# EAGLE design Clock2 (EAGLE 6.5.0)
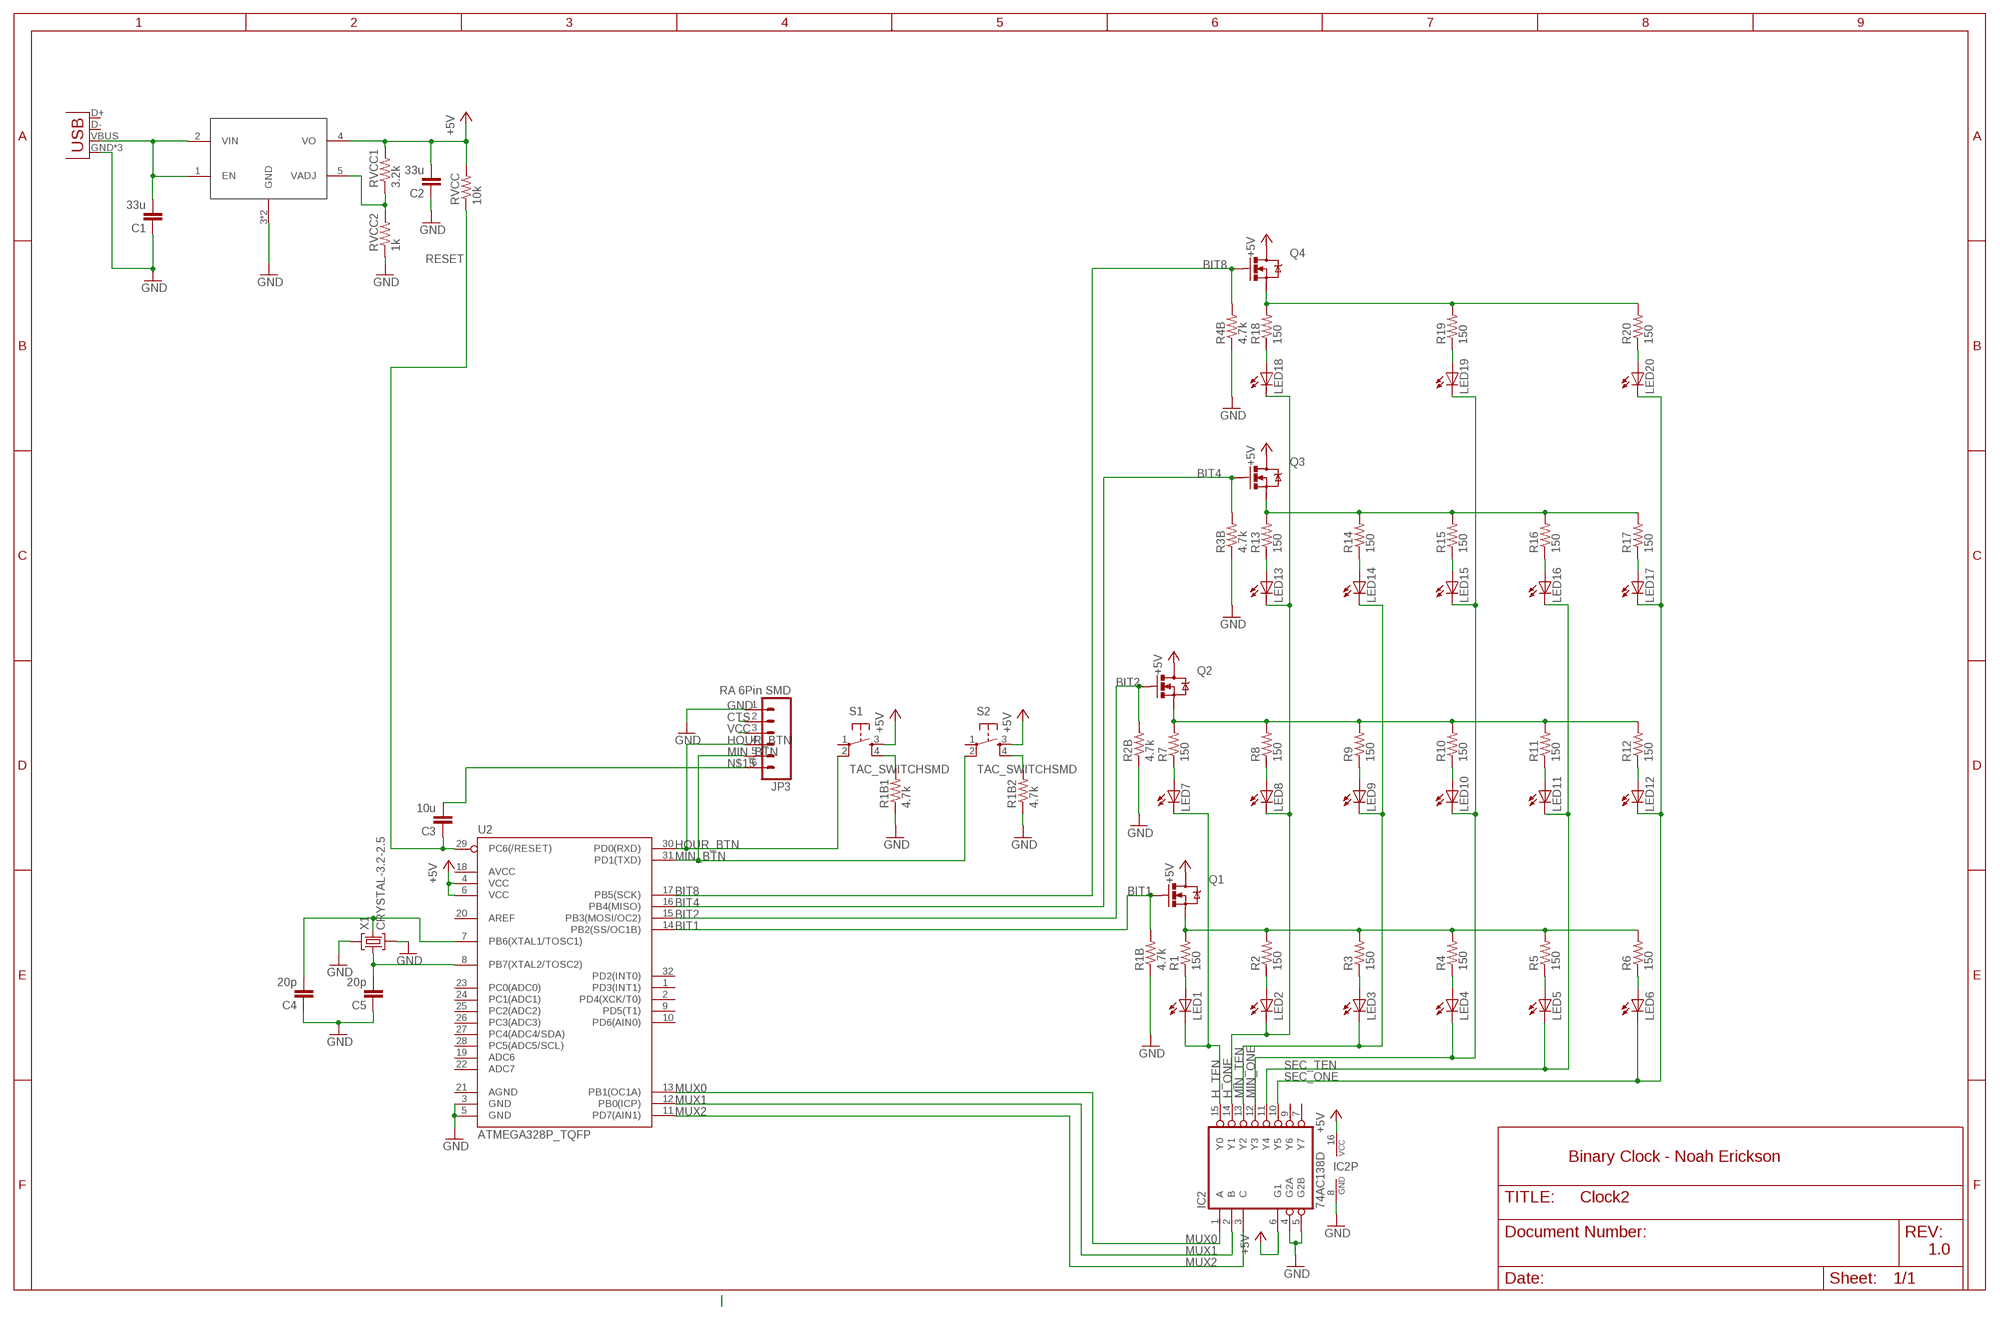
[diagram p0: schematic, sheet 1]

## Parts
C1  33u  C-EUC1206  [C1206]
C2  33u  C-EUC1206  [C1206]
C3  10u  C-EUC1206  [C1206]
C4  20p  C-EUC1206  [C1206]
C5  20p  C-EUC1206  [C1206]
IC2  74AC138D  [SO16]
JP1  USB-MICROB  [USB-MICROB]
JP3  RA 6Pin SMD  M06SMD  [1X06-SMD]
LED1  LEDSML1206  [SML1206]
LED2  LEDSML1206  [SML1206]
LED3  LEDSML1206  [SML1206]
LED4  LEDSML1206  [SML1206]
LED5  LEDSML1206  [SML1206]
LED6  LEDSML1206  [SML1206]
LED7  LEDSML1206  [SML1206]
LED8  LEDSML1206  [SML1206]
LED9  LEDSML1206  [SML1206]
LED10  LEDSML1206  [SML1206]
LED11  LEDSML1206  [SML1206]
LED12  LEDSML1206  [SML1206]
LED13  LEDSML1206  [SML1206]
LED14  LEDSML1206  [SML1206]
LED15  LEDSML1206  [SML1206]
LED16  LEDSML1206  [SML1206]
LED17  LEDSML1206  [SML1206]
LED18  LEDSML1206  [SML1206]
LED19  LEDSML1206  [SML1206]
LED20  LEDSML1206  [SML1206]
Q1  MOSFET-NCHANNELBSS138  [SOT23-3]
Q2  MOSFET-NCHANNELBSS138  [SOT23-3]
Q3  MOSFET-NCHANNELBSS138  [SOT23-3]
Q4  MOSFET-NCHANNELBSS138  [SOT23-3]
R1  150  R-US_R1206  [R1206]
R1B  4.7k  R-US_R1206  [R1206]
R1B1  4.7k  R-US_R1206  [R1206]
R1B2  4.7k  R-US_R1206  [R1206]
R2  150  R-US_R1206  [R1206]
R2B  4.7k  R-US_R1206  [R1206]
R3  150  R-US_R1206  [R1206]
R3B  4.7k  R-US_R1206  [R1206]
R4  150  R-US_R1206  [R1206]
R4B  4.7k  R-US_R1206  [R1206]
R5  150  R-US_R1206  [R1206]
R6  150  R-US_R1206  [R1206]
R7  150  R-US_R1206  [R1206]
R8  150  R-US_R1206  [R1206]
R9  150  R-US_R1206  [R1206]
R10  150  R-US_R1206  [R1206]
R11  150  R-US_R1206  [R1206]
R12  150  R-US_R1206  [R1206]
R13  150  R-US_R1206  [R1206]
R14  150  R-US_R1206  [R1206]
R15  150  R-US_R1206  [R1206]
R16  150  R-US_R1206  [R1206]
R17  150  R-US_R1206  [R1206]
R18  150  R-US_R1206  [R1206]
R19  150  R-US_R1206  [R1206]
R20  150  R-US_R1206  [R1206]
RVCC  10k  R-US_R1206  [R1206]
RVCC1  3.2k  R-US_R1206  [R1206]
RVCC2  1k  R-US_R1206  [R1206]
S1  TAC_SWITCHSMD  [TACTILE-SWITCH-SMD]
S2  TAC_SWITCHSMD  [TACTILE-SWITCH-SMD]
U2  ATMEGA328P_TQFP  [TQFP32-08]
U$1  TLF1963  [DPAK]
X1  CRYSTAL-3.2-2.5  [CRYSTAL-3.2-2.5]

## Nets
+5V: C2.2 IC2.6(G1) IC2.16(VCC) Q1.3(D) Q2.3(D) Q3.3(D) Q4.3(D) RVCC1.2 RVCC.2 S1.3 S2.3 U2.4(VCC) U2.6(VCC) U$1.4(VO)
BIT1: Q1.1(G) R1B.2 U2.14(PB2(SS/OC1B))
BIT2: Q2.1(G) R2B.2 U2.15(PB3(MOSI/OC2))
BIT4: Q3.1(G) R3B.2 U2.16(PB4(MISO))
BIT8: Q4.1(G) R4B.2 U2.17(PB5(SCK))
CTS: JP3.2
GND: C1.1 C2.1 C4.1 C5.1 IC2.4(G2A) IC2.5(G2B) IC2.8(GND) JP1.GND JP1.MT1(GND) JP1.MT2(GND) JP3.1 R1B1.1 R1B2.1 R1B.1 R2B.1 R3B.1 R4B.1 RVCC2.1 U2.3(GND) U2.5(GND) U$1.3(GND) U$1.6(GND) X1.2(GND) X1.4(GND)
H_ONE: IC2.14(Y1) LED2.C LED8.C LED13.C LED18.C
H_TEN: IC2.15(Y0) LED1.C LED7.C
HOUR_BTN: JP3.4 S1.2 U2.30(PD0(RXD))
MIN_BTN: JP3.5 S2.2 U2.31(PD1(TXD))
MIN_ONE: IC2.12(Y3) LED4.C LED10.C LED15.C LED19.C
MIN_TEN: IC2.13(Y2) LED3.C LED9.C LED14.C
MUX0: IC2.1(A) U2.13(PB1(OC1A))
MUX1: IC2.2(B) U2.12(PB0(ICP))
MUX2: IC2.3(C) U2.11(PD7(AIN1))
N$1: C1.2 JP1.VBUS U$1.1(EN) U$1.2(VIN)
N$2: C5.2 U2.8(PB7(XTAL2/TOSC2)) X1.1(C1)
N$4: C4.2 U2.7(PB6(XTAL1/TOSC1)) X1.3(C2)
N$7: Q4.2(S) R18.2 R19.2 R20.2
N$9: LED1.A R1.1
N$10: Q1.2(S) R1.2 R2.2 R3.2 R4.2 R5.2 R6.2
N$11: R1B1.2 S1.4
N$12: R1B2.2 S2.4
N$13: LED2.A R2.1
N$14: RVCC1.1 RVCC2.2 U$1.5(VADJ)
N$15: C3.2 JP3.6
N$17: LED3.A R3.1
N$21: LED7.A R7.1
N$22: Q2.2(S) R7.2 R8.2 R9.2 R10.2 R11.2 R12.2
N$25: LED8.A R8.1
N$28: LED13.A R13.1
N$29: LED9.A R9.1
N$32: Q3.2(S) R13.2 R14.2 R15.2 R16.2 R17.2
N$34: LED4.A R4.1
N$38: LED5.A R5.1
N$40: LED18.A R18.1
N$42: LED6.A R6.1
N$46: LED10.A R10.1
N$50: LED11.A R11.1
N$54: LED12.A R12.1
N$60: LED14.A R14.1
N$64: LED15.A R15.1
N$68: LED19.A R19.1
N$72: LED16.A R16.1
N$76: LED17.A R17.1
N$80: LED20.A R20.1
RESET: C3.1 RVCC.1 U2.29(PC6(/RESET))
SEC_ONE: IC2.10(Y5) LED6.C LED12.C LED17.C LED20.C
SEC_TEN: IC2.11(Y4) LED5.C LED11.C LED16.C
VCC: JP3.3
Unconnected: IC2.7(Y7) IC2.9(Y6) JP1.D+ JP1.D- S1.1 S2.1 U2.1(PD3(INT1)) U2.2(PD4(XCK/T0)) U2.9(PD5(T1)) U2.10(PD6(AIN0)) U2.18(AVCC) U2.19(ADC6) U2.20(AREF) U2.21(AGND) U2.22(ADC7) U2.23(PC0(ADC0)) U2.24(PC1(ADC1)) U2.25(PC2(ADC2)) U2.26(PC3(ADC3)) U2.27(PC4(ADC4/SDA)) U2.28(PC5(ADC5/SCL)) U2.32(PD2(INT0))

## Notes on the sheet
- Binary Clock - Noah Erickson
- 1.0

## Library data of the parts
C1-C5 = rcl:C-EU: CAPACITOR, European symbol
IC2 = 74xx-eu:74*138: 3-line to 8-line DECODER/DEMULTIPLEXER
JP1 = SparkFun-Connectors:USB: USB Connectors USB-B-PTH is fully proven SKU : PRT-00139/CONN-08278 USB-miniB is fully proven SKU : PRT-00587 USB-A-PCB is untested. USB-A-H is throughly reviewed, but untested. Spark Fun Electronics SKU : PRT-00437 USB-B-SMT is throughly reviewed, but untested. Needs silkscreen touching up. USB-A-S has not been used/tested USB-MB-H has not been used/tested USB-MICROB has been used. CONN-09505; PROD_ID: CONN-09505
JP3 = SparkFun-Connectors:M06: Header 6 Standard 6-pin 0.1" header. Use with straight break away headers (SKU : PRT-00116), right angle break away headers (PRT-00553), swiss pins (PRT-00743), machine pins (PRT-00117), and female headers (PRT-00115). Molex polarized connector foot print use with SKU : PRT-08094 with associated crimp pins and housings. NOTES ON THE VARIANTS LOCK and LOCK_LONGPADS... This footprint was designed to help hold the alignment of a through-hole component (i.e. 6-pin header) while soldering it into place. You may notice that each hole has been shifted either up or down by 0.005 of an inch from it's more standard position (which is a perfectly straight line). This slight alteration caused the pins (the squares in the middle) to touch the edges of the holes. Because they are alternating, it causes a "brace" to hold the component in place. 0.005 has proven to be the perfect amount of "off-center" position when using our standard breakaway headers. Although looks a little odd when you look at the bare footprint, once you have a header in there, the alteration is very hard to notice. Also,if you push a header all the way into place, it is covered up entirely on the bottom side. This idea of altering the position of holes to aid alignment will be further integrated into the Sparkfun Library for other footprints. It can help hold any component with 3 or more connection pins.; PROD_ID: CONN-08971
LED1-LED20 = led:LED: LED OSRAM: - CHIPLED LG R971, LG N971, LY N971, LG Q971, LY Q971, LO R971, LY R971 LH N974, LH R974 LS Q976, LO Q976, LY Q976 LO Q996 - Hyper CHIPLED LW Q18S LB Q993, LB Q99A, LB R99A - SideLED LS A670, LO A670, LY A670, LG A670, LP A670 LB A673, LV A673, LT A673, LW A673 LH A674 LY A675 LS A676, LA A676, LO A676, LY A676, LW A676 LS A679, LY A679, LG A679 - Hyper Micro SIDELED® LS Y876, LA Y876, LO Y876, LY Y876 LT Y87S - SmartLED LW L88C, LW L88S LB L89C, LB L89S, LG L890 LS L89K, LO L89K, LY L89K LS L896, LA L896, LO L896, LY L896 - TOPLED LS T670, LO T670, LY T670, LG T670, LP T670 LSG T670, LSP T670, LSY T670, LOP T670, LYG T670 LG T671, LOG T671, LSG T671 LB T673, LV T673, LT T673, LW T673 LH T674 LS T676, LA T676, LO T676, LY T676, LB T676, LH T676, LSB T676, LW T676 LB T67C, LV T67C, LT T67C, LS T67K, LO T67K, LY T67K, LW E67C LS E67B, LA E67B, LO E67B, LY E67B, LB E67C, LV E67C, LT E67C LW T67C LS T679, LY T679, LG T679 LS T770, LO T770, LY T770, LG T770, LP T770 LB T773, LV T773, LT T773, LW T773 LH T774 LS E675, LA E675, LY E675, LS T675 LS T776, LA T776, LO T776, LY T776, LB T776 LHGB T686 LT T68C, LB T68C - Hyper Mini TOPLED® LB M676 - Mini TOPLED Santana® LG M470 LS M47K, LO M47K, LY M47K Source: http://www.osram.convergy.de LUXEON: - LUMILED® LXK2-PW12-R00, LXK2-PW12-S00, LXK2-PW14-U00, LXK2-PW14-V00 LXK2-PM12-R00, LXK2-PM12-S00, LXK2-PM14-U00 LXK2-PE12-Q00, LXK2-PE12-R00, LXK2-PE12-S00, LXK2-PE14-T00, LXK2-PE14-U00 LXK2-PB12-K00, LXK2-PB12-L00, LXK2-PB12-M00, LXK2-PB14-N00, LXK2-PB14-P00, LXK2-PB14-Q00 LXK2-PR12-L00, LXK2-PR12-M00, LXK2-PR14-Q00, LXK2-PR14-R00 LXK2-PD12-Q00, LXK2-PD12-R00, LXK2-PD12-S00 LXK2-PH12-R00, LXK2-PH12-S00 LXK2-PL12-P00, LXK2-PL12-Q00, LXK2-PL12-R00 Source: www.luxeon.com KINGBRIGHT: KA-3528ASYC Source: www.kingbright.com
Q1-Q4 = SparkFun-DiscreteSemi:MOSFET-NCHANNEL: Common NMOSFET Parts MFG P/N Store ID Prod ID FDD8780 TRANS-09984 SI7820DN TRANS-11055 FDS6630A IC-08089 2N7002PW TRANS-11151 FQP30N06L COM-10213 TRANS-10060 BSS123LT1G TRANS-08345 BSS138 TRANS-00830 BS170 2N7000; PROD_ID: TRANS-00830
R1 R1B R1B1 R1B2 R2 R2B R3 R3B R4 R4B R5-R20 RVCC RVCC1 RVCC2 = rcl:R-US_: RESISTOR, American symbol
S1 S2 = SparkFun-Electromechanical:TAC_SWITCH: Momentary Switch Button commonly used for reset or general input. Spark Fun Electronics SKU : COM-00097 SMT- SWCH-08247; PROD_ID: SWCH-08247
U2 = SparkFun-DigitalIC:ATMEGA328P_TQFP; PROD_ID: IC-09069
U$1 = Dash parts:TLF1963
X1 = SmartPrj:CRYSTAL-3.2-2.5

## Board
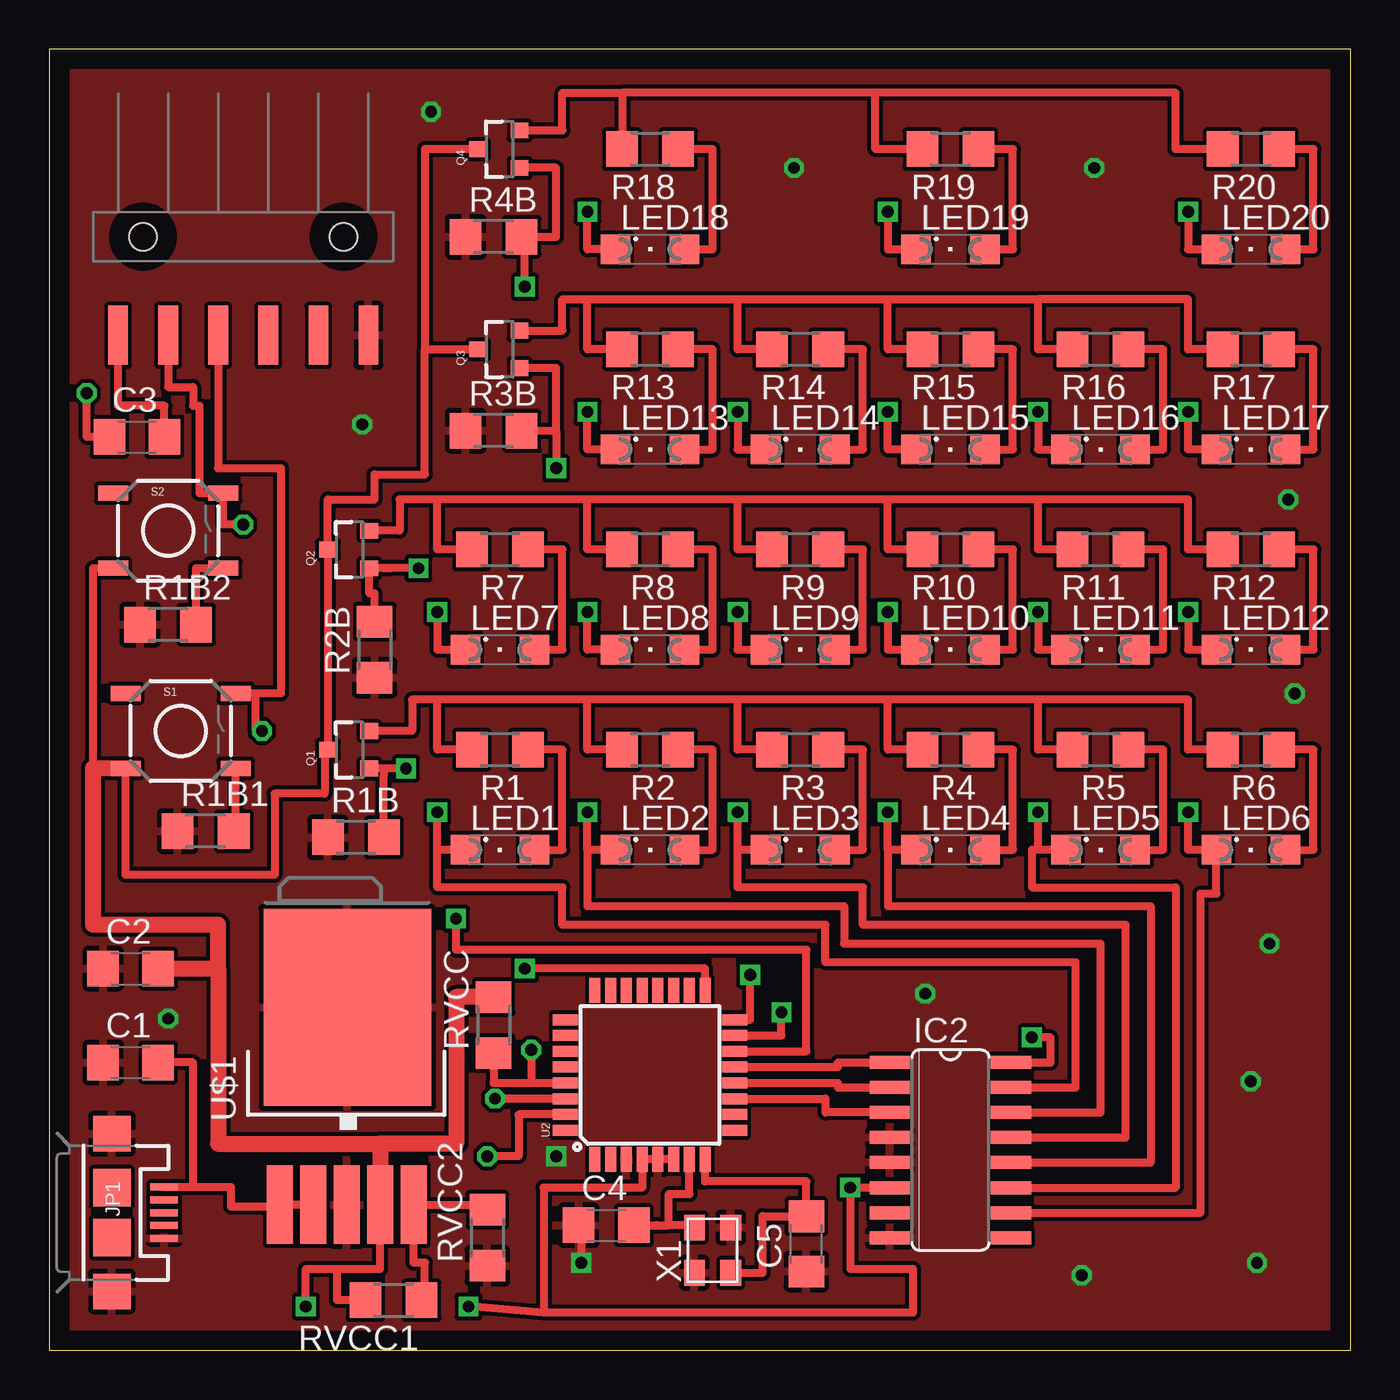
[diagram p1: board, top side]
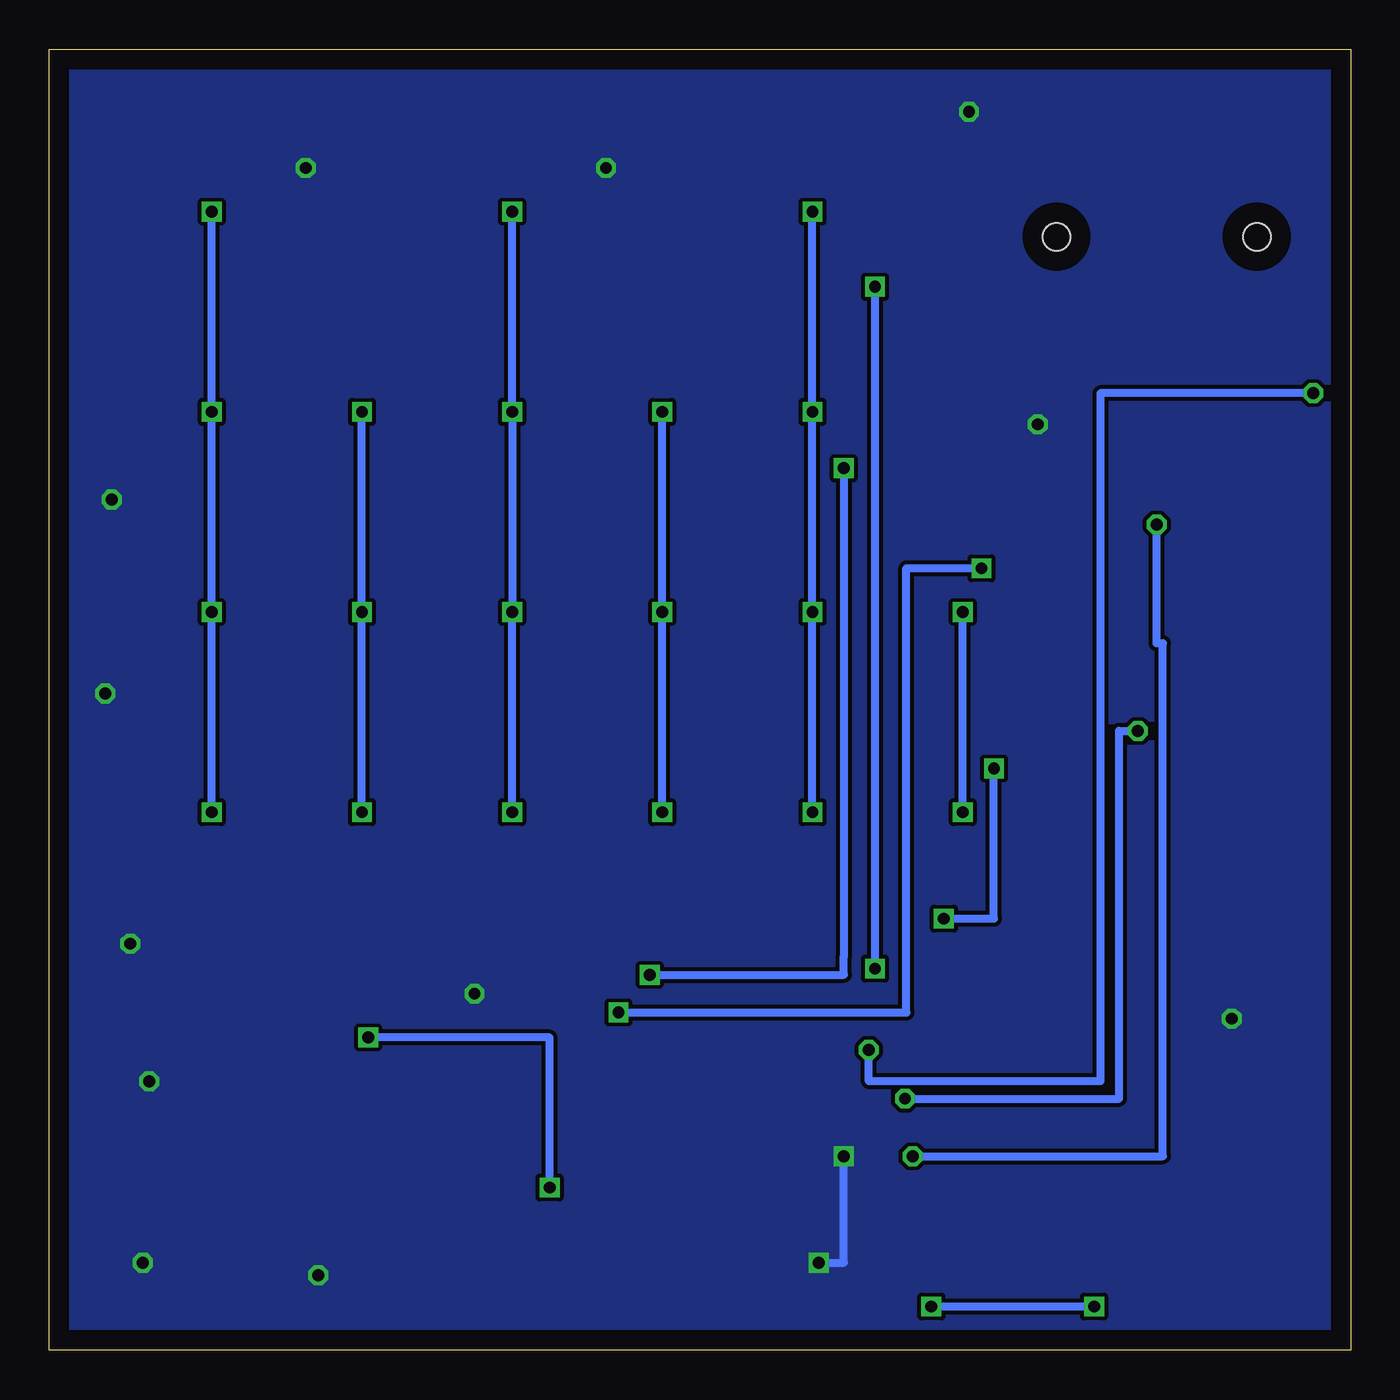
[diagram p2: board, bottom side, seen from below]

Size 66.03 x 66.03 mm. Coordinates in mm from the lower left corner, seen from the top.
Outline: 0,0 66.03,0 66.03,66.03 0,66.03 0,0
Copper layers (1*16): Top 0.035mm / dielectric 1.5mm / Bottom 0.035mm
Design rules "default": minimum track width 10mil, minimum drill 24mil, track to track 8mil, track to pad 8mil, pad to pad 8mil, via to via 8mil, smd to smd 8mil, copper to edge 40mil, drill to drill 8mil, minimum pad ring 10mil, minimum via ring 8mil, stop-mask expansion 4mil, vias tented up to drill 0mil, thermal gap 10mil

### Footprints (pad centres in the part's own frame; a part is rotated, then mirrored left to right if it is on the bottom)
C1206 = smd 1.6 x 1.8: 1 -1.4,0; 2 1.4,0
SO16 = smd 0.66 x 2.032: 1 -4.445,-3.073; 2 -3.175,-3.073; 3 -1.905,-3.073; 4 -0.635,-3.073; 5 0.635,-3.073; 6 1.905,-3.073; 7 3.175,-3.073; 8 4.445,-3.073; 9 4.445,3.073; 10 3.175,3.073; 11 1.905,3.073; 12 0.635,3.073; 13 -0.635,3.073; 14 -1.905,3.073; 15 -3.175,3.073; 16 -4.445,3.073
USB-MICROB = smd 0.35 x 1.4: D+ 0,2.65; D- -0.65,2.65; GND 1.3,2.65; ID 0.65,2.65; VBUS -1.3,2.65 | smd 1.8 x 1.9: MT1 -4,0; MT2 4,0 | smd 1.9 x 1.9: P$1 -1.27,0; P$2 1.27,0
1X06-SMD = smd 1 x 3: 1 -6.35,5; 2 -3.81,5; 3 -1.27,5; 4 1.27,5; 5 3.81,5; 6 6.35,5 | hole 1.4: -5.08,0; 5.08,0
SML1206 = smd 1.5 x 1.5: A 1.75,0; C -1.75,0
SOT23-3 = smd 0.8 x 0.9: 1 -0.95,-1; 2 0.95,-1; 3 0,1.1
R1206 = smd 1.6 x 1.803: 1 -1.422,0; 2 1.422,0
TACTILE-SWITCH-SMD = smd 1.524 x 0.762: 1 -2.794,1.905; 2 2.794,1.905; 3 -2.794,-1.905; 4 2.794,-1.905
TQFP32-08 = smd 1.27 x 0.559: 1 -4.293,2.8; 2 -4.293,2; 3 -4.293,1.2; 4 -4.293,0.4; 5 -4.293,-0.4; 6 -4.293,-1.2; 7 -4.293,-2; 8 -4.293,-2.8; 17 4.293,-2.8; 18 4.293,-2; 19 4.293,-1.2; 20 4.293,-0.4; 21 4.293,0.4; 22 4.293,1.2; 23 4.293,2; 24 4.293,2.8 | smd 0.559 x 1.27: 9 -2.8,-4.293; 10 -2,-4.293; 11 -1.2,-4.293; 12 -0.4,-4.293; 13 0.4,-4.293; 14 1.2,-4.293; 15 2,-4.293; 16 2.8,-4.293; 25 2.8,4.293; 26 2,4.293; 27 1.2,4.293; 28 0.4,4.293; 29 -0.4,4.293; 30 -1.2,4.293; 31 -2,4.293; 32 -2.8,4.293
DPAK = smd 1.31 x 4: 1 -2.28,-4.04; 2 -0.58,-4.04; 3 1.12,-4.04; 4 2.82,-4.04; 5 4.52,-4.04 | smd 8.5 x 10: 6 1.15,5.97
CRYSTAL-3.2-2.5 = smd 1.3 x 1.05: 1 -1.15,-0.925; 2 1.15,-0.925; 3 1.15,0.925; 4 -1.15,0.925

### Placement (x,y rotation side)
C1  4.13,14.61 0 top
C2  4.13,19.37 0 top
C3  4.45,46.35 0 top
C4  28.26,6.35 0 top
C5  38.42,5.4 90 top
IC2  45.72,10.16 270 top
JP1  3.17,6.99 270 top
JP3  9.84,56.52 180 top
LED1  22.86,25.4 0 top
LED2  30.48,25.4 0 top
LED3  38.1,25.4 0 top
LED4  45.72,25.4 0 top
LED5  53.34,25.4 0 top
LED6  60.96,25.4 0 top
LED7  22.86,35.56 0 top
LED8  30.48,35.56 0 top
LED9  38.1,35.56 0 top
LED10  45.72,35.56 0 top
LED11  53.34,35.56 0 top
LED12  60.96,35.56 0 top
LED13  30.48,45.72 0 top
LED14  38.1,45.72 0 top
LED15  45.72,45.72 0 top
LED16  53.34,45.72 0 top
LED17  60.96,45.72 0 top
LED18  30.48,55.88 0 top
LED19  45.72,55.88 0 top
LED20  60.96,55.88 0 top
Q1  15.24,30.48 90 top
Q2  15.24,40.64 90 top
Q3  22.86,50.8 90 top
Q4  22.86,60.96 90 top
R1  22.86,30.48 180 top
R1B  15.56,26.04 0 top
R1B1  7.94,26.35 0 top
R1B2  6.03,36.83 0 top
R2  30.48,30.48 180 top
R2B  16.51,35.56 90 top
R3  38.1,30.48 180 top
R3B  22.54,46.67 0 top
R4  45.72,30.48 180 top
R4B  22.54,56.52 0 top
R5  53.34,30.48 180 top
R6  60.96,30.48 180 top
R7  22.86,40.64 180 top
R8  30.48,40.64 180 top
R9  38.1,40.64 180 top
R10  45.72,40.64 180 top
R11  53.34,40.64 180 top
R12  60.96,40.64 180 top
R13  30.48,50.8 180 top
R14  38.1,50.8 180 top
R15  45.72,50.8 180 top
R16  53.34,50.8 180 top
R17  60.96,50.8 180 top
R18  30.48,60.96 180 top
R19  45.72,60.96 180 top
R20  60.96,60.96 180 top
RVCC  22.54,16.51 90 top
RVCC1  17.46,2.54 180 top
RVCC2  22.23,5.71 90 top
S1  6.67,31.43 0 top
S2  6.03,41.59 0 top
U2  30.48,13.97 90 top
U$1  13.97,11.43 0 top
X1  33.66,5.08 90 top

### Tracks (layer width: path | path; a pad name or v marks a point on that pad's centre or on a via)
+5V  (via drill 0.6)
  Top 0.406: IC2.16 50.8,14.61 50.8,15.88 v49.85,15.88 | IC2.6 v40.64,8.26 40.64,4.13 43.81,4.13 43.81,1.91 25.08,1.91 | 25.08,1.91 v21.27,2.22 | RVCC1.2 14.61,2.54 14.61,4.13 | 14.61,4.13 16.79,4.13 U$1.4 | v13.02,2.22 13.02,4.13 14.61,4.13 | Q4.3 19.05,60.96 19.05,50.8 | 19.05,50.8 Q3.3 | 19.05,50.8 19.05,44.45 16.51,44.45 16.51,43.18 14.14,43.18 Q2.3 Q1.3 13.97,30.48 13.97,28.26 11.43,28.26 11.43,24.13 3.87,24.13 S1.3 | 25.08,1.91 25.08,8.26 30.08,8.26 U2.4 U2.6 | 2.22,29.53 2.22,39.69 S2.3
  Top 0.813: C2.2 8.57,19.37 | 8.57,19.37 8.57,10.48 16.79,10.48 | 16.79,10.48 U$1.4 | 8.57,19.37 8.57,21.59 2.22,21.59 2.22,29.53 S1.3 | RVCC.2 20.64,17.93 20.64,10.48 16.79,10.48
  Bottom 0.406: v40.64,8.26 40.64,15.88 v49.85,15.88 | v21.27,2.22 v13.02,2.22
BIT1  (via drill 0.6)
  Top 0.406: R1B.2 16.98,29.21 16.98,29.53 | 16.98,29.53 Q1.1 | U2.14 38.42,15.17 38.42,20.32 20.64,20.32 v20.64,21.91 | v18.1,29.53 16.98,29.53
  Bottom 0.406: v20.64,21.91 18.1,21.91 v18.1,29.53
BIT2  (via drill 0.6)
  Top 0.406: U2.15 37.15,15.97 v37.15,17.14 | v18.73,39.69 16.98,39.69 17.3,39.69 Q2.1 16.24,38.42 16.51,38.42 R2B.2
  Bottom 0.406: v37.15,17.14 22.54,17.14 22.54,39.69 v18.73,39.69
BIT4  (via drill 0.6)
  Top 0.406: R3B.2 25.72,46.67 | 25.72,46.67 25.72,49.85 Q3.1 | 25.72,46.67 v25.72,44.77 | U2.16 35.56,16.77 v35.56,19.05
  Bottom 0.406: v25.72,44.77 25.72,20.32 25.72,20 25.72,19.05 v35.56,19.05
BIT8  (via drill 0.6)
  Top 0.406: Q4.1 25.72,60.01 25.72,56.52 R4B.2 24.13,56.52 v24.13,53.98 | U2.17 33.28,19.37 v24.13,19.37
  Bottom 0.406: v24.13,19.37 v24.13,53.98
GND  (via drill 0.6)
  Top 0.406: C4.1 arc-90 26.99,6.22 v26.99,4.45 | v25.72,9.84 26.04,9.84
  Bottom 0.406: v26.99,4.45 25.72,4.45 v25.72,9.84
  other vias: 60.96,13.65 61.28,4.45 52.39,3.81 61.91,20.64 44.45,18.1 63.18,33.34 62.87,43.18 53.02,60.01 37.78,60.01 19.37,62.87 15.88,46.99 6.03,16.83
  pour Top: 0,0 101.6,0 64.77,65.41 0,66.04
  pour Bottom: 0,0 101.6,0 101.6,78.74 0,78.74
H_ONE  (via drill 0.6)
  Top 0.406: IC2.14 53.34,12.06 53.34,20.64 40.32,20.64 40.32,22.54 27.3,22.54 27.3,25.4 | LED13.C 27.3,45.72 v27.3,47.62 | LED18.C 27.3,55.88 v27.3,57.78 | LED8.C 27.3,35.56 v27.3,37.47 | LED2.C 27.3,25.4 | 27.3,25.4 v27.3,27.3
  Bottom 0.406: v27.3,57.78 v27.3,47.62 v27.3,37.47 v27.3,27.3
H_TEN  (via drill 0.6)
  Top 0.406: IC2.15 52.07,13.34 52.07,19.68 39.37,19.68 39.37,21.59 26.04,21.59 26.04,23.5 19.68,23.5 19.68,25.4 | LED1.C 19.68,25.4 | 19.68,25.4 v19.68,27.3 | v19.68,37.47 19.68,35.56 LED7.C
  Bottom 0.406: v19.68,27.3 v19.68,37.47
HOUR_BTN  (via drill 0.6)
  Top 0.406: U2.30 v22.61,12.77 | JP3.4 8.57,44.77 11.75,44.77 11.75,33.34 10.48,33.34 | 10.48,33.34 S1.2 | v10.79,31.43 10.48,31.43 10.48,33.34
  Bottom 0.406: v22.61,12.77 11.75,12.77 11.75,31.43 v10.79,31.43
MIN_BTN  (via drill 0.6)
  Top 0.406: U2.31 23.81,11.97 23.81,9.84 v22.23,9.84 | JP3.5 6.03,48.9 7.3,48.9 7.3,47.94 7.62,47.94 7.62,43.5 S2.2 8.83,41.91 v9.84,41.91
  Bottom 0.406: v22.23,9.84 9.53,9.84 9.53,35.88 9.84,35.88 v9.84,41.91
MIN_ONE  (via drill 0.6)
  Top 0.406: IC2.12 55.88,9.53 55.88,22.54 42.55,22.54 42.55,25.4 | v42.55,37.47 42.55,35.56 LED10.C | LED15.C 42.55,45.72 v42.55,47.62 | v42.55,57.78 42.55,55.88 LED19.C | LED4.C 42.55,25.4 | 42.55,25.4 v42.55,27.3
  Bottom 0.406: v42.55,27.3 v42.55,37.47 v42.55,47.62 v42.55,57.78
MIN_TEN  (via drill 0.6)
  Top 0.406: IC2.13 54.61,10.79 54.61,21.59 41.27,21.59 41.27,23.5 34.92,23.5 34.92,25.4 | LED3.C 34.92,25.4 | 34.92,25.4 v34.92,27.3 | v34.92,37.47 34.92,35.56 LED9.C | v34.92,47.62 34.92,45.72 LED14.C
  Bottom 0.406: v34.92,27.3 v34.92,37.47 v34.92,47.62
MUX0
  Top 0.406: U2.13 40.01,14.37 40.01,14.61 IC2.1
MUX1
  Top 0.406: U2.12 40.01,13.57 40.01,13.34 IC2.2
MUX2
  Top 0.406: U2.11 39.37,12.77 39.37,12.06 42.23,12.06 IC2.3
N$1
  Top 0.406: U$1.2 U$1.1 11.69,7.3 9.21,7.3 9.21,8.29 JP1.VBUS 7.3,8.29 7.3,14.61 C1.2
N$2
  Top 0.406: U2.8 33.28,8.57 38.42,8.57 C5.2 36.2,6.8 36.2,3.93 X1.1
N$4
  Top 0.406: C4.2 30.8,6.35 31.43,6.35 | 31.43,6.35 31.43,7.94 32.48,7.94 U2.7 | X1.3 32.73,6.35 31.43,6.35
N$7
  Top 0.406: Q4.2 26.04,61.91 26.04,63.82 29.06,63.82 | 29.06,63.82 R18.2 | R19.2 41.91,60.96 41.91,63.82 | 41.91,63.82 29.06,63.82 | R20.2 57.15,60.96 57.15,63.82 41.91,63.82
N$9
  Top 0.406: LED1.A 26.04,25.4 26.04,30.48 R1.1
N$10
  Top 0.406: R6.2 57.78,30.48 57.78,33.02 50.16,33.02 | 50.16,33.02 42.55,33.02 | 42.55,33.02 34.92,33.02 | 34.92,33.02 27.3,33.02 | 27.3,33.02 19.68,33.02 | 19.68,33.02 18.41,33.02 18.41,31.43 Q1.2 | R1.2 19.68,30.48 19.68,33.02 | R2.2 27.3,30.48 27.3,33.02 | R3.2 34.92,30.48 34.92,33.02 | R4.2 42.55,30.48 42.55,33.02 | R5.2 50.16,30.48 50.16,33.02
N$11
  Top 0.406: R1B1.2 9.46,26.35 S1.4
N$12
  Top 0.406: R1B2.2 7.46,39.69 S2.4
N$13
  Top 0.406: LED2.A 33.66,25.4 33.66,30.48 R2.1
N$14
  Top 0.406: RVCC2.2 22.23,7.39 U$1.5 18.49,4.45 19.05,4.45 19.05,2.54 RVCC1.1
N$15
  Top 0.406: C3.2 5.84,47.94 3.49,47.94 JP3.6
N$17
  Top 0.406: LED3.A 41.27,25.4 41.27,30.48 R3.1
N$21
  Top 0.406: LED7.A 26.04,35.56 26.04,40.64 R7.1
N$22
  Top 0.406: R12.2 57.78,40.64 57.78,43.18 50.16,43.18 | 50.16,43.18 42.55,43.18 | 42.55,43.18 34.92,43.18 | 34.92,43.18 27.3,43.18 | 27.3,43.18 19.68,43.18 | 19.68,43.18 17.78,43.18 17.78,41.59 Q2.2 | R7.2 19.68,40.64 19.68,43.18 | R8.2 27.3,40.64 27.3,43.18 | R9.2 34.92,40.64 34.92,43.18 | R10.2 42.55,40.64 42.55,43.18 | R11.2 50.16,40.64 50.16,43.18
N$25
  Top 0.406: LED8.A 33.66,35.56 33.66,40.64 R8.1
N$28
  Top 0.406: LED13.A 33.66,45.72 33.66,50.8 R13.1
N$29
  Top 0.406: LED9.A 41.27,35.56 41.27,40.64 R9.1
N$32
  Top 0.406: Q3.2 26.04,51.75 26.04,53.34 27.3,53.34 | 27.3,53.34 34.92,53.34 | 34.92,53.34 42.55,53.34 | 42.55,53.34 50.16,53.34 | R16.2 50.16,50.8 50.16,53.34 | R15.2 42.55,50.8 42.55,53.34 | R14.2 34.92,50.8 34.92,53.34 | R13.2 27.3,50.8 27.3,53.34 | R17.2 57.78,50.8 57.78,53.34 50.16,53.34
N$34
  Top 0.406: LED4.A 48.9,25.4 48.9,30.48 R4.1
N$38
  Top 0.406: LED5.A 56.52,25.4 56.52,30.48 R5.1
N$40
  Top 0.406: LED18.A 33.66,55.88 33.66,60.96 R18.1
N$42
  Top 0.406: LED6.A 64.14,25.4 64.14,30.48 R6.1
N$46
  Top 0.406: LED10.A 48.9,35.56 48.9,40.64 R10.1
N$50
  Top 0.406: LED11.A 56.52,35.56 56.52,40.64 R11.1
N$54
  Top 0.406: LED12.A 64.14,35.56 64.14,40.64 R12.1
N$60
  Top 0.406: LED14.A 41.27,45.72 41.27,50.8 R14.1
N$64
  Top 0.406: LED15.A 48.9,45.72 48.9,50.8 R15.1
N$68
  Top 0.406: LED19.A 48.9,55.88 48.9,60.96 R19.1
N$72
  Top 0.406: LED16.A 56.52,45.72 56.52,50.8 R16.1
N$76
  Top 0.406: LED17.A 64.14,45.72 64.14,50.8 R17.1
N$80
  Top 0.406: LED20.A 64.14,55.88 64.14,60.96 R20.1
RESET  (via drill 0.6)
  Top 0.406: RVCC.1 22.54,13.57 24.45,13.57 | 24.45,13.57 U2.29 | C3.1 1.91,46.35 v1.91,48.58 | v24.45,15.24 24.45,13.57
  Bottom 0.406: v1.91,48.58 12.7,48.58 12.7,13.65 24.45,13.65 v24.45,15.24
SEC_ONE  (via drill 0.6)
  Top 0.406: IC2.10 58.42,6.99 58.42,23.18 59.21,23.18 LED6.C 57.78,25.4 v57.78,27.3 | LED17.C 57.78,45.72 v57.78,47.62 | v57.78,57.78 57.78,55.88 LED20.C | v57.78,37.47 57.78,35.56 LED12.C
  Bottom 0.406: v57.78,57.78 v57.78,47.62 v57.78,37.47 v57.78,27.3
SEC_TEN  (via drill 0.6)
  Top 0.406: IC2.11 57.15,8.26 57.15,23.5 49.85,23.5 49.85,25.4 50.16,25.4 | LED5.C 50.16,25.4 | 50.16,25.4 v50.16,27.3 | v50.16,37.47 50.16,35.56 LED11.C | v50.16,47.62 50.16,45.72 LED16.C
  Bottom 0.406: v50.16,27.3 v50.16,37.47 v50.16,47.62